# EAGLE design CMC_NIBP (EAGLE 9.1.2)
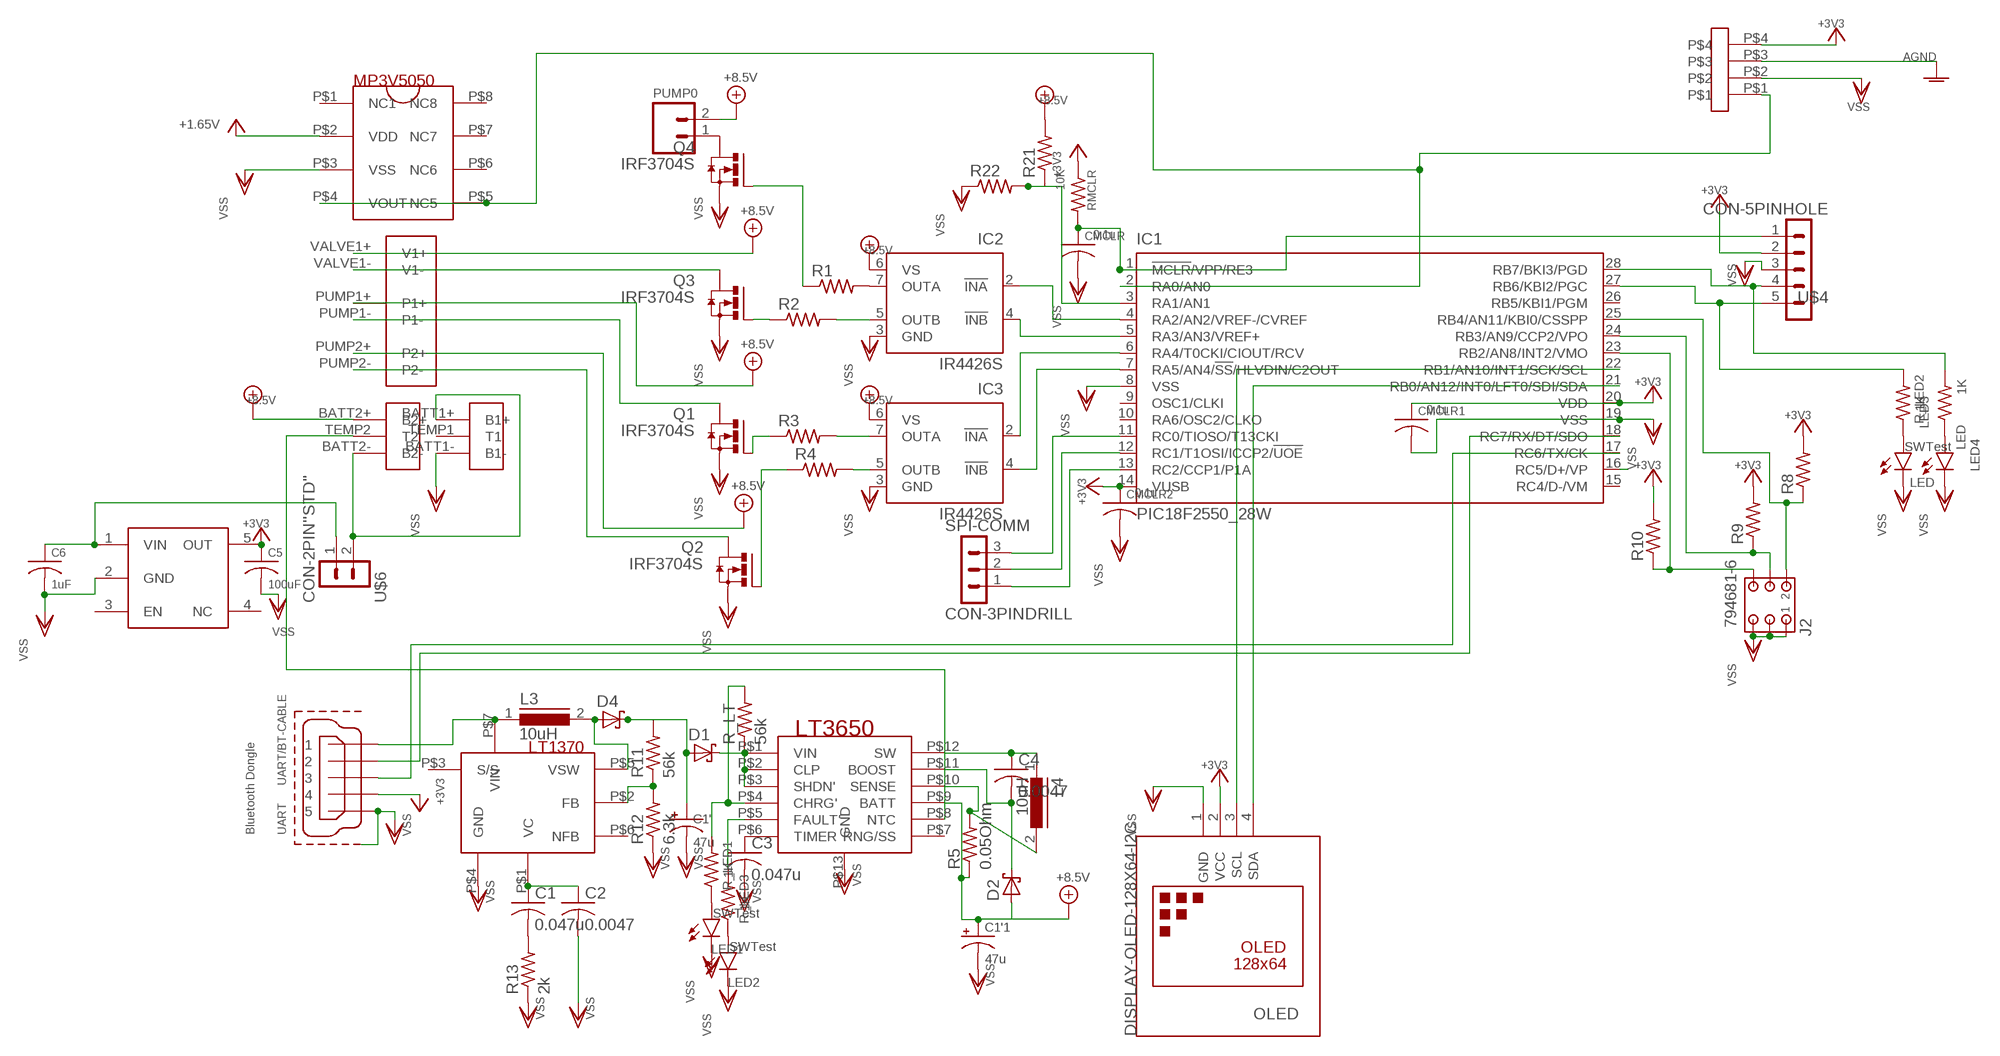
[diagram p0: schematic, sheet 1]

## Parts
C1  0.047u  C-USC1206  [C1206]
C1'  47u  CPOL-USE5-10.5  [E5-10,5]
C1'1  47u  CPOL-USE5-10.5  [E5-10,5]
C2  0.0047  C-USC1206  [C1206]
C3  0.047u  C-USC1206  [C1206]
C4  0.0047  C-USC1206  [C1206]
C5  100uF  C-USC1210  [C1210]
C6  1uF  C-USC0603  [C0603]
CMCLR  0.1u  C-USC0603  [C0603]
CMCLR1  0.1u  C-USC0603  [C0603]
CMCLR2  0.1u  C-USC0603  [C0603]
D1  SCHOTTKY-DIODESMD  [SMB]
D2  SCHOTTKY-DIODESMD  [SMB]
D4  SCHOTTKY-DIODESMD  [SMB]
IC1  PIC18F2550_28W  [SO28W]
IC2  IR4426S  [SO08]
IC3  IR4426S  [SO08]
IC-3.3VREG  LDO-MIC5307  [SOT23-5]
J2  794681-6  [794681-6]
L3  10uH  DR73  [DR73]
L4  10uH  DR73  [DR73]
LED  SWTest  LED3MM  [LED3MM]
LED1  SWTest  LED3MM  [LED3MM]
LED2  SWTest  LED3MM  [LED3MM]
LED3  1K  R-US_0204/2V  [0204V]
LED4  LED  LED3MM  [LED3MM]
OLED  DISPLAY-OLED-128X64-I2C  [DISPLAY-OLED-128X64-I2C]
PUMP0  Pump0  M02  [02P]
Q1  IRF3704S  [D2PACK]
Q2  IRF3704S  [D2PACK]
Q3  IRF3704S  [D2PACK]
Q4  IRF3704S  [D2PACK]
R1  R-US_M1206  [M1206]
R2  R-US_M1206  [M1206]
R3  R-US_M1206  [M1206]
R4  R-US_M1206  [M1206]
R5  0.05Ohm  R-US_M1206  [M1206]
R8  R-US_M1206  [M1206]
R9  R-US_M1206  [M1206]
R10  R-US_M1206  [M1206]
R11  56k  R-US_M1206  [M1206]
R12  6.3k  R-US_M1206  [M1206]
R13  2k  R-US_M1206  [M1206]
R21  R-US_M1206  [M1206]
R22  R-US_M1206  [M1206]
R_LED1  1K  R-US_0204/2V  [0204V]
R_LED2  1K  R-US_0204/2V  [0204V]
R_LED3  1K  R-US_0204/2V  [0204V]
R_LT  56k  R-US_M1206  [M1206]
RMCLR  10K  R-US_R0603  [R0603]
SPI-COMM  CON-3PINDRILL  [CON-3PIN]
U$1  NIBP_PNEUMATICS  [NIBP_PNEUM]
U$2  LT1370  [DD-PACK-7LEAD]
U$3  LT3650  [MSOP-12]
U$4  CON-5PINHOLE  [CON-5PIN]
U$5  CON-4PIN_SIL  [CONN-4PINSIL2]
U$6  CON-2PIN''STD"  [CON-2PIN]
UART/BT-CABLE  UART  MICRO-USB1  [MICRO-USB1]

## Nets
+3V3: C5.1 CMCLR1.1 CMCLR2.1 IC1.14(VUSB) IC1.20(VDD) IC-3.3VREG.5(OUT) OLED.2(VCC) R8.2 R9.2 R10.2 RMCLR.1 U$1.P$2(VDD) U$4.2 U$5.P$4 UART/BT-CABLE.4 ; supply symbol labelled +1.65V
+9V: C1'1.+ D2.A IC2.6(VS) IC3.6(VS) PUMP0.2 R5.1 R21.2 U$1.BATT2+(B2+) U$1.PUMP1+(P1+) U$1.PUMP2+(P2+) U$1.VALVE1+(V1+) U$3.P$9(BATT) ; supply symbol labelled +8.5V
+9V2: R_LED1.2 R_LT.2 U$3.P$4(CHRG')
AGND: U$5.P$3
BATT-MONITOR: IC1.3(RA1/AN1) R21.1 R22.2
DISP-SCL: IC1.22(RB1/AN10/INT1/SCK/SCL) OLED.3(SCL)
DISP-SDA: IC1.21(RB0/AN12/INT0/LFT0/SDI/SDA) OLED.4(SDA)
N$1: PUMP0.1 Q4.2(D)
N$2: U$1.TEMP2(T2) U$3.P$8(NTC)
N$3: IC1.16(RC5/D+/VP)
N$4: R_LED3.2 U$3.P$5(FAULT')
N$5: LED2.A R_LED3.1
N$6: U$1.BATT1+(B1+) U$1.BATT2-(B2-) U$6.2
N$7: C6.1 IC-3.3VREG.1(VIN) U$6.1
N$8: Q2.1(G) R4.1
N$9: Q1.1(G) R3.1
N$10: Q4.1(G) R1.1
N$11: IC3.7(OUTA) R3.2
N$12: IC2.7(OUTA) R1.2
N$13: IC2.5(OUTB) R2.2
N$14: L3.1 U$2.P$7(VIN) UART/BT-CABLE.1
N$16: IC3.5(OUTB) R4.2
N$23: D4.A L3.2 U$2.P$5(VSW)
N$24: LED3.1 LED4.A
N$25: C1'.+ D1.A D4.C R11.2
N$26: R11.1 R12.2 U$2.P$2(FB)
N$27: D1.C R_LT.1 U$3.P$1(VIN) U$3.P$2(CLP) U$3.P$3(SHDN')
N$28: C1.1 C2.1 U$2.P$1(VC)
N$29: C1.2 R13.2
N$30: C4.1 L4.1 U$3.P$12(SW)
N$31: C3.1 U$3.P$6(TIMER)
N$32: L4.2 R5.2 U$3.P$10(SENSE)
N$33: C4.2 D2.C U$3.P$11(BOOST)
N$34: LED1.A R_LED1.1
N$41: LED.A R_LED2.1
PGC: IC1.27(RB6/KBI2/PGC) R_LED2.2 U$4.5
PGD: IC1.28(RB7/BKI3/PGD) LED3.2 U$4.4
PIC-RX_CABLE-TX: IC1.18(RC7/RX/DT/SDO) UART/BT-CABLE.2
PIC-TX_CABLE-RX: IC1.17(RC6/TX/CK) UART/BT-CABLE.3
PRESSURE-SIG: IC1.2(RA0/AN0) U$1.P$4(VOUT) U$1.P$5(NC5) U$5.P$1
PUMP1: Q1.2(D) U$1.PUMP1-(P1-)
PUMP1-A: IC1.6(RA4/T0CKI/CIOUT/RCV) IC3.2(!INA)
PUMP2: Q2.2(D) U$1.PUMP2-(P2-)
PUMP2-A: IC1.7(RA5/AN4/!SS!/HLVDIN/C2OUT) IC3.4(!INB)
SCK: IC1.11(RC0/TIOSO/T13CKI) SPI-COMM.3
SDI: IC1.13(RC2/CCP1/P1A) SPI-COMM.1
SDO: IC1.12(RC1/T1OSI/ICCP2/!UOE) SPI-COMM.2
SW1: IC1.23(RB2/AN8/INT2/VMO) J2.6 R10.1
SW2: IC1.24(RB3/AN9/CCP2/VPO) J2.4 R9.1
SW3: IC1.25(RB4/AN11/KBI0/CSSPP) J2.2 R8.1
VALVE1-A: IC1.4(RA2/AN2/VREF-/CVREF) IC2.2(!INA)
VALVE2: Q3.2(D) U$1.VALVE1-(V1-)
VALVE2-A: IC1.5(RA3/AN3/VREF+) IC2.4(!INB)
VALVE2-B: Q3.1(G) R2.1
VPP: CMCLR.1 IC1.1(!MCLR!/VPP/RE3) RMCLR.2 U$4.1
VSS: C1'1.- C1'.- C2.2 C3.2 C5.2 C6.2 CMCLR1.2 CMCLR2.2 CMCLR.2 IC1.8(VSS) IC1.19(VSS) IC2.3(GND) IC3.3(GND) IC-3.3VREG.2(GND) J2.1 J2.3 J2.5 LED1.K(C) LED2.K(C) LED4.K(C) LED.K(C) OLED.1(GND) Q1.3(S) Q2.3(S) Q3.3(S) Q4.3(S) R12.1 R13.1 R22.1 U$1.BATT1-(B1-) U$1.P$3(VSS) U$2.P$4(GND) U$3.P$13(GND) U$4.3 U$5.P$2 UART/BT-CABLE.5
Unconnected: IC1.9(OSC1/CLKI) IC1.10(RA6/OSC2/CLKO) IC1.15(RC4/D-/VM) IC1.26(RB5/KBI1/PGM) IC-3.3VREG.3(EN) IC-3.3VREG.4(NC) U$1.P$1(NC1) U$1.P$6(NC6) U$1.P$7(NC7) U$1.P$8(NC8) U$1.TEMP1(T1) U$2.P$3(S/S) U$2.P$6(NFB) U$3.P$7(RNG/SS)

## Notes on the sheet
- Bluetooth Dongle

## Library data of the parts
C1-C6 CMCLR CMCLR1 CMCLR2 = rcl:C-US: CAPACITOR, American symbol; SPICEPREFIX: C
C1' C1'1 = rcl:CPOL-US: POLARIZED CAPACITOR, American symbol; SPICEPREFIX: C
D1 D2 D4 = diode:SCHOTTKY-DIODE: Schottky Diode
IC1 = CMCbioengg:PIC18F2*_28: USB Microcontrollers with nanoWatt Technology High-Performance, Enhanced Flash, 28/40/44-Pin, Source: http://ww1.microchip.com/downloads/en/devicedoc/39632c.pdf; MF: MICROCHIP; MPN: PIC18F2550-I/SO; OC_FARNELL: 9321268; OC_NEWARK: 73K1297
IC2 IC3 = ir:IR4426: DUAL LOW SIDE DRIVER Source: ID4426.pdf; MF: INTERNATIONAL RECTIFIER(IR); MPN: IR4426S; OC_FARNELL: 1023266; OC_NEWARK: 27C6913
IC-3.3VREG = surdev_Aug2015:LDO-MIC5307
J2 = con-amp:794681-6: Micro MATE-N-LOK Connectors grid 1.5mm Dual Row Through Hole Vertical Metal Through Hole Holddowns Source: ENG_CD_794681_E.pdf
L3 L4 = inductors:DR73: High Power Density, High Efficiency, Shielded Inductors Source: coiltronics_dr_series.pdf; SPICEPREFIX: L
LED LED1 LED2 LED4 = led:LED: LED OSRAM: - CHIPLED LG R971, LG N971, LY N971, LG Q971, LY Q971, LO R971, LY R971 LH N974, LH R974 LS Q976, LO Q976, LY Q976 LO Q996 - Hyper CHIPLED LW Q18S LB Q993, LB Q99A, LB R99A - SideLED LS A670, LO A670, LY A670, LG A670, LP A670 LB A673, LV A673, LT A673, LW A673 LH A674 LY A675 LS A676, LA A676, LO A676, LY A676, LW A676 LS A679, LY A679, LG A679 - Hyper Micro SIDELED® LS Y876, LA Y876, LO Y876, LY Y876 LT Y87S - SmartLED LW L88C, LW L88S LB L89C, LB L89S, LG L890 LS L89K, LO L89K, LY L89K LS L896, LA L896, LO L896, LY L896 - TOPLED LS T670, LO T670, LY T670, LG T670, LP T670 LSG T670, LSP T670, LSY T670, LOP T670, LYG T670 LG T671, LOG T671, LSG T671 LB T673, LV T673, LT T673, LW T673 LH T674 LS T676, LA T676, LO T676, LY T676, LB T676, LH T676, LSB T676, LW T676 LB T67C, LV T67C, LT T67C, LS T67K, LO T67K, LY T67K, LW E67C LS E67B, LA E67B, LO E67B, LY E67B, LB E67C, LV E67C, LT E67C LW T67C LS T679, LY T679, LG T679 LS T770, LO T770, LY T770, LG T770, LP T770 LB T773, LV T773, LT T773, LW T773 LH T774 LS E675, LA E675, LY E675, LS T675 LS T776, LA T776, LO T776, LY T776, LB T776 LHGB T686 LT T68C, LB T68C - Hyper Mini TOPLED® LB M676 - Mini TOPLED Santana® LG M470 LS M47K, LO M47K, LY M47K Source: http://www.osram.convergy.de LUXEON: - LUMILED® LXK2-PW12-R00, LXK2-PW12-S00, LXK2-PW14-U00, LXK2-PW14-V00 LXK2-PM12-R00, LXK2-PM12-S00, LXK2-PM14-U00 LXK2-PE12-Q00, LXK2-PE12-R00, LXK2-PE12-S00, LXK2-PE14-T00, LXK2-PE14-U00 LXK2-PB12-K00, LXK2-PB12-L00, LXK2-PB12-M00, LXK2-PB14-N00, LXK2-PB14-P00, LXK2-PB14-Q00 LXK2-PR12-L00, LXK2-PR12-M00, LXK2-PR14-Q00, LXK2-PR14-R00 LXK2-PD12-Q00, LXK2-PD12-R00, LXK2-PD12-S00 LXK2-PH12-R00, LXK2-PH12-S00 LXK2-PL12-P00, LXK2-PL12-Q00, LXK2-PL12-R00 Source: www.luxeon.com KINGBRIGHT: KA-3528ASYC Source: www.kingbright.com
LED3 R1-R5 R8-R13 R21 R22 R_LED1-R_LED3 R_LT RMCLR = rcl:R-US_: RESISTOR, American symbol; SPICEPREFIX: R
OLED = diy-modules:DISPLAY-OLED-128X64-I2C: 128x64 Dot Matrix OLED Module based on SSD1306 chip Variant with I2C interface More details available here: http://www.instructables.com/id/Monochrome-096-i2c-OLED-display-with-arduino-SSD13/ SSD1306 datasheet: https://cdn-shop.adafruit.com/datasheets/SSD1306.pdf Click here to find device on ebay.com <http://www.ebay.com/sch/oled+display+128x64+iic> Note: There are two variants: I2C and SPI. Search for the proper version.
PUMP0 = con-amp-quick:M02: AMP QUICK CONNECTOR; OC_FARNELL: unknown; OC_NEWARK: unknown
Q1-Q4 = transistor-power:IRF3704: SMPS MOSFET HEXFET® Power MOSFET Source: http://www.irf.com/product-info/datasheets/data/irf3704.pdf
SPI-COMM = CMCbioengg:CON-3PIN
U$1 = CMCbioengg:NIBP_PNEUMATICS
U$2 = CMCbioengg:LT1370
U$3 = CMCbioengg:LT3650
U$4 = CMCbioengg:CON-5PIN
U$5 = CMCbioengg:CON-4PIN_SIL
U$6 = CMCbioengg:CON-2PIN
UART/BT-CABLE = Syrpai_01012015:MICRO-USB1

## Net classes
1 power: width 0.61 mm, drill 0.61 mm, clearance 0.254 mm
2 gnd: width 0.305 mm, drill 0.559 mm, clearance 0.254 mm
3 usbvcc: width 0.508 mm, drill 0.61 mm, clearance 0.254 mm
4 aref: width 0.406 mm, drill 0.61 mm, clearance 0.254 mm

## Board
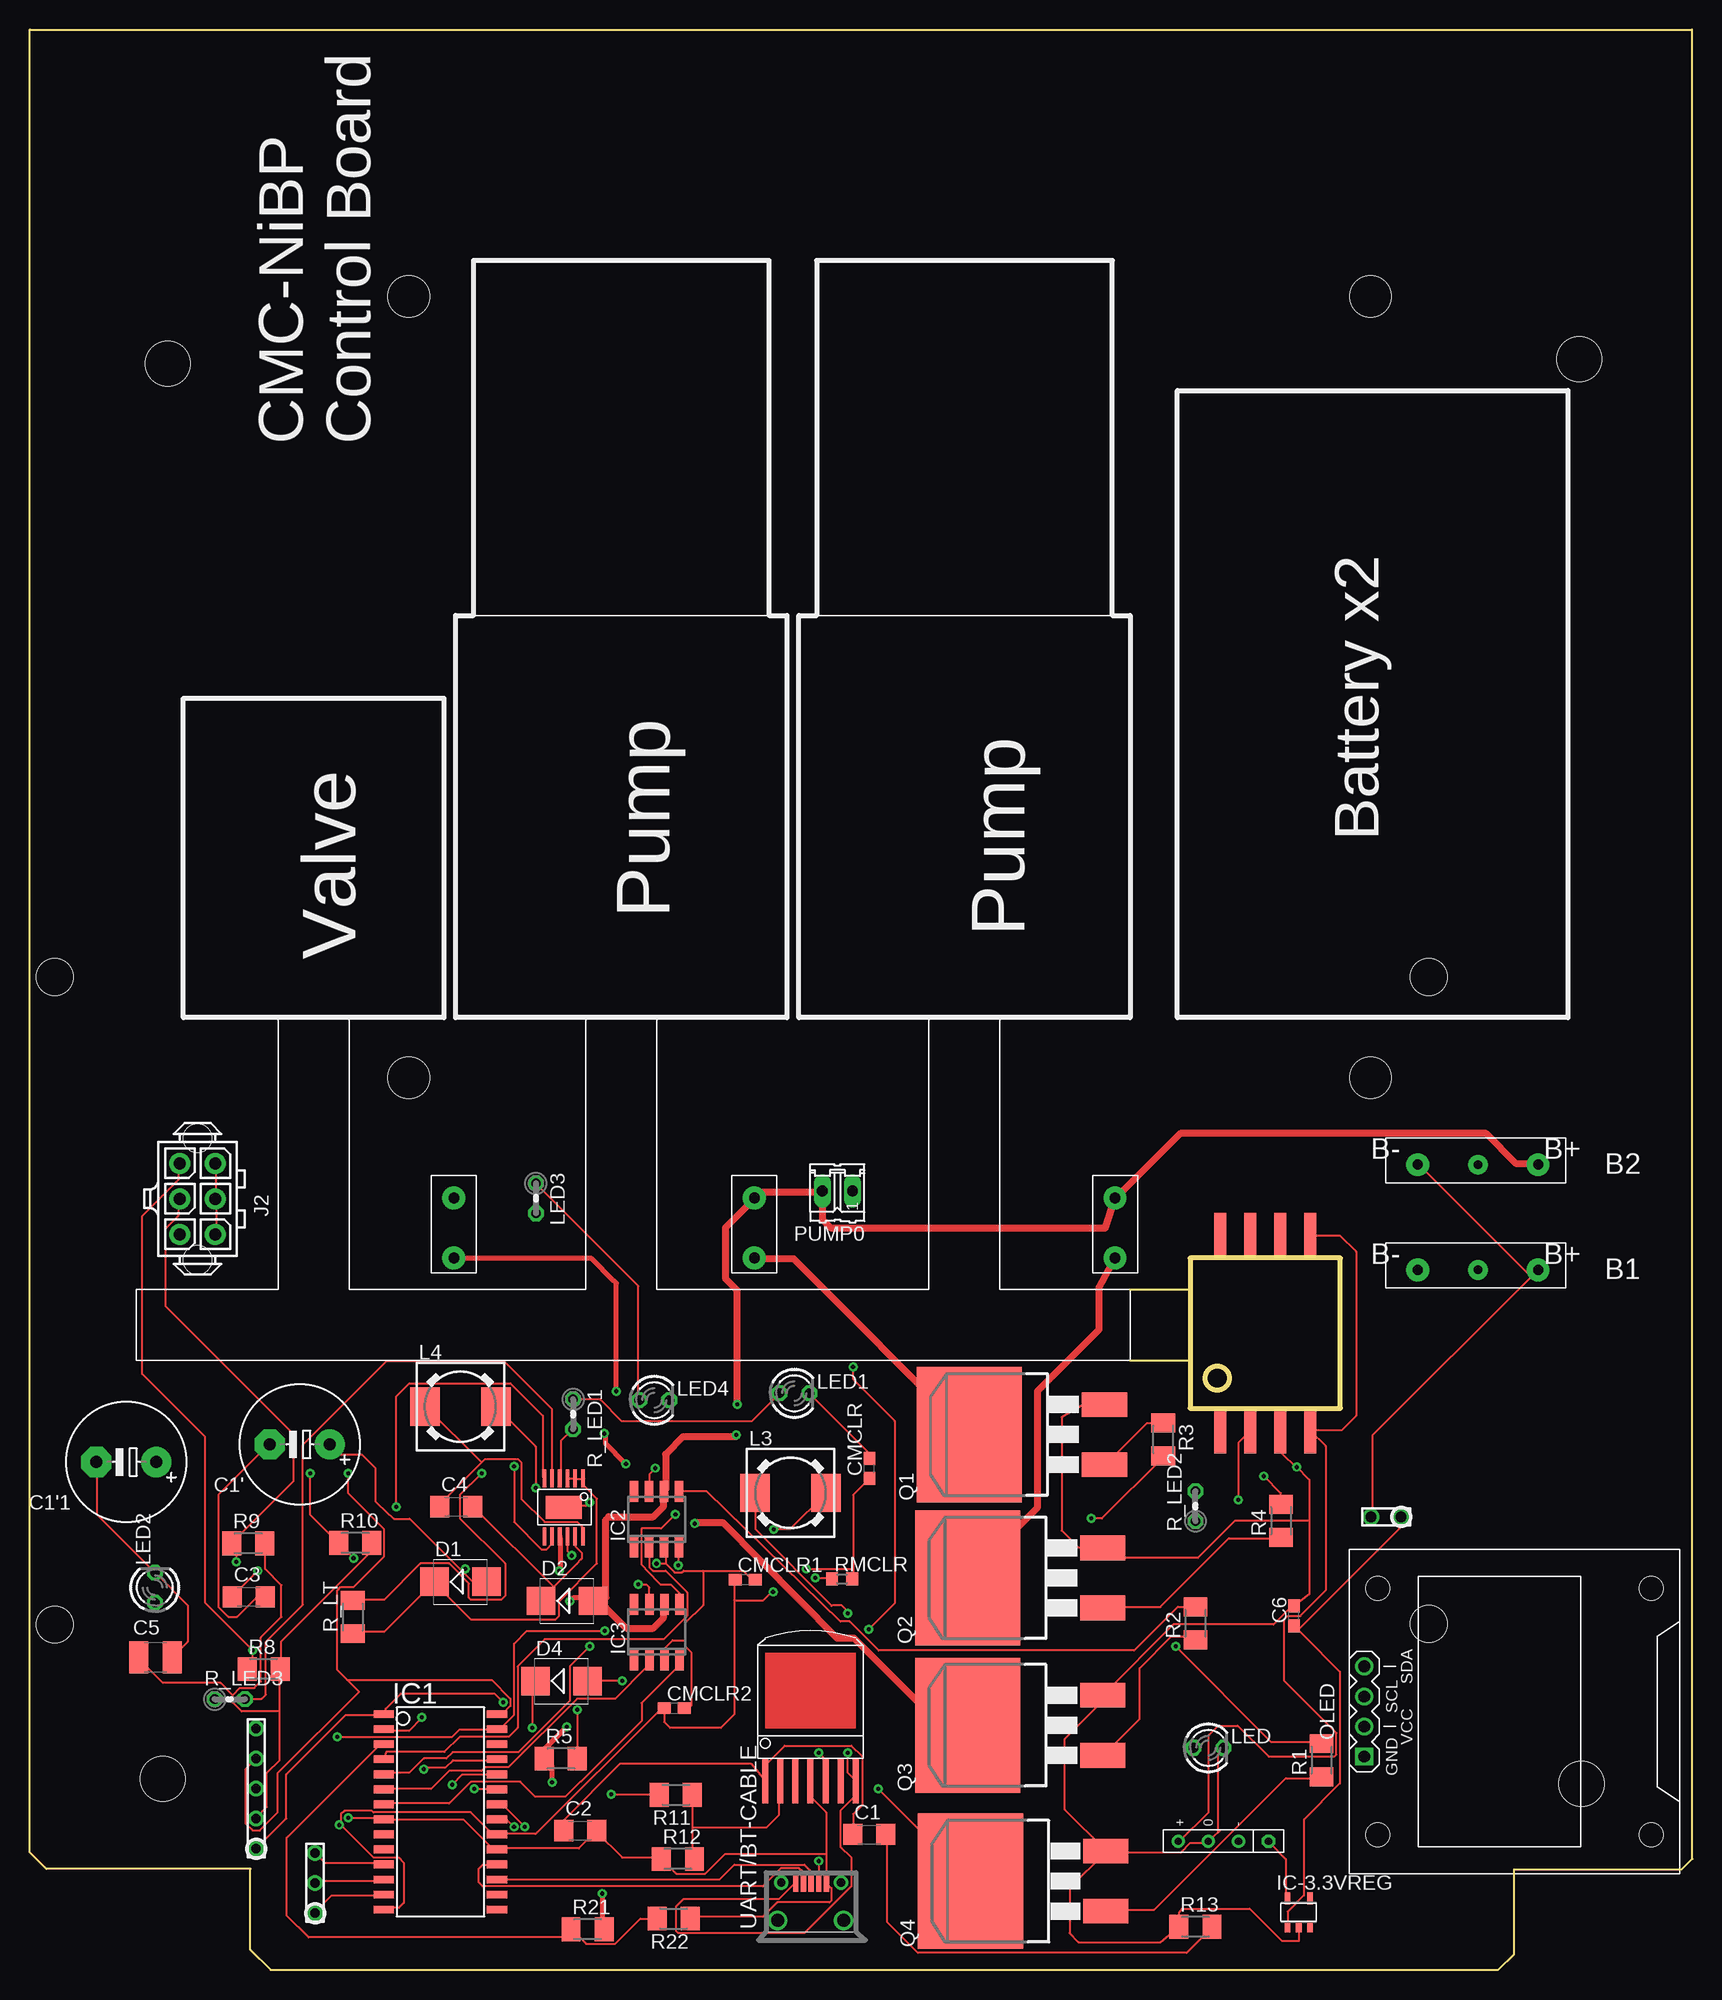
[diagram p1: board, top side]
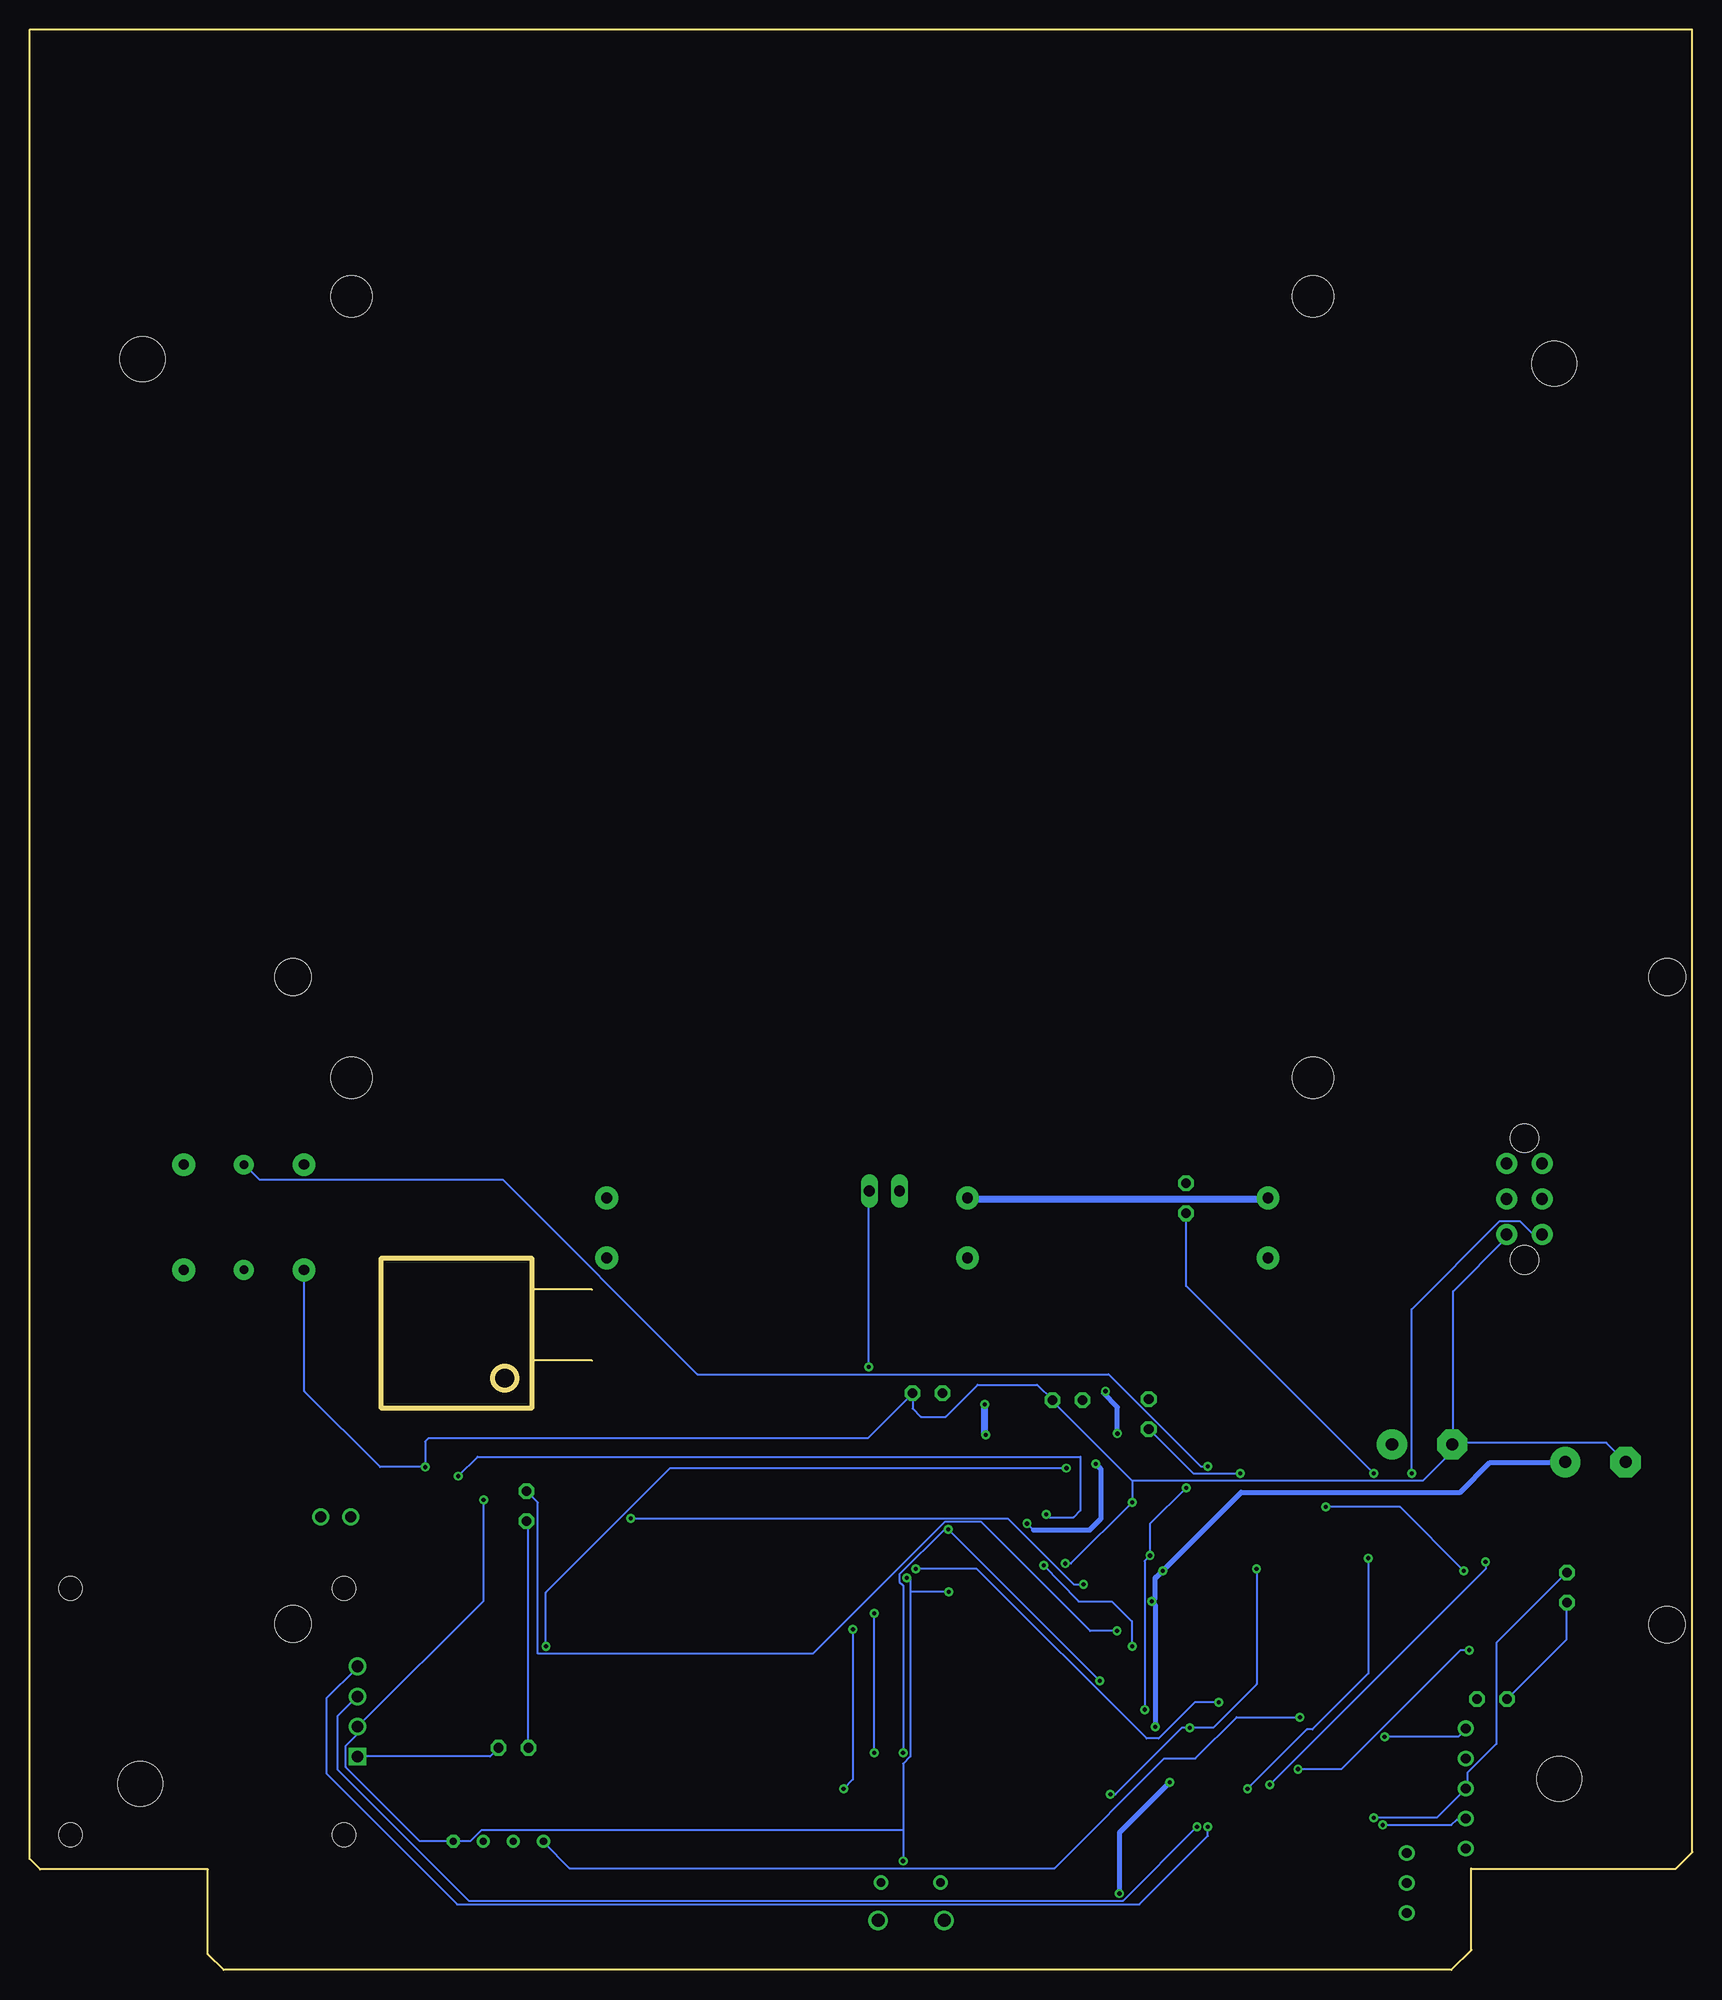
[diagram p2: board, bottom side, seen from below]

Size 140.51 x 164.02 mm. Coordinates in mm from the lower left corner, seen from the top.
Outline: 18.66,1.71 20.37,0 124.11,0 125.45,1.34 125.45,8.49
Outline: 18.68,8.54 1.41,8.54 0,9.95 0.01,164
Outline: 125.45,8.49 139.62,8.49 140.51,9.38 140.5,164.02
Outline: 0.04,164.02 140.5,164.02 140.5,164.02
Outline: 18.66,1.69 18.66,8.55 18.68,8.55
Copper layers (1*16): Top 0.035mm / dielectric 1.5mm / Bottom 0.035mm
Design rules "default": minimum track width 6mil, minimum drill 0.35mm, track to track 6mil, track to pad 6mil, pad to pad 6mil, via to via 6mil, smd to smd 6mil, copper to edge 40mil, drill to drill 6mil, minimum pad ring 10mil, minimum via ring 8mil, stop-mask expansion 4mil, vias tented up to drill 0mil, thermal gap 10mil
Holes 3.1 mm at 2.13,29.19 2.13,83.94 118.25,83.94 118.25,29.26
Holes 3.8 mm at 11.24,16.17 11.67,135.79 130.98,136.17 131.15,15.72

### Footprints (pad centres in the part's own frame; a part is rotated, then mirrored left to right if it is on the bottom)
C1206 = smd 1.6 x 1.8: 1 -1.4,0; 2 1.4,0
E5-10,5 = drill 1.016 pad 2.54: + -2.54,0 | drill 1.016 pad 2.54 octagon: - 2.54,0
C1210 = smd 1.6 x 2.7: 1 -1.4,0; 2 1.4,0
C0603 = smd 1.1 x 1: 1 -0.85,0; 2 0.85,0
SMB = smd 2.4 x 2.4: A 2.2,0; C -2.2,0
SO28W = smd 0.65 x 1.7: 1 -7.62,-4.78; 2 -6.35,-4.78; 3 -5.08,-4.78; 4 -3.81,-4.78; 5 -2.54,-4.78; 6 -1.27,-4.78; 7 0,-4.78; 8 1.27,-4.78; 9 2.54,-4.78; 10 3.81,-4.78; 11 5.08,-4.78; 12 6.35,-4.78; 13 7.62,-4.78; 14 8.89,-4.78; 15 8.89,4.78; 16 7.62,4.78; 17 6.35,4.78; 18 5.08,4.78; 19 3.81,4.78; 20 2.54,4.78; 21 1.27,4.78; 22 0,4.78; 23 -1.27,4.78; 24 -2.54,4.78; 25 -3.81,4.78; 26 -5.08,4.78; 27 -6.35,4.78; 28 -7.62,4.78
SO08 = smd 0.72 x 1.78: 1 -1.905,-2.35; 2 -0.635,-2.35; 3 0.635,-2.35; 4 1.905,-2.35; 5 1.905,2.35; 6 0.635,2.35; 7 -0.635,2.35; 8 -1.905,2.35
SOT23-5 = smd 0.5 x 1: 1 -0.95,-1.2; 2 0,-1.2; 3 0.95,-1.2; 4 0.95,1.2; 5 -0.95,1.2
794681-6 = drill 1 pad 1.778: 1 3,-1.5; 2 3,1.5; 3 0,-1.5; 4 0,1.5; 5 -3,-1.5; 6 -3,1.5 | hole 2.4: 5.13,0; -5.17,0
DR73 = smd 2.5 x 3.25: 1 -3,0; 2 3,0
LED3MM = drill 0.813 octagon: A -1.27,0; K 1.27,0
0204V = drill 0.813 octagon: 1 -1.27,0; 2 1.27,0
DISPLAY-OLED-128X64-I2C = drill 1 square: 1 -3.81,12.7 | drill 1: 2 -1.27,12.7; 3 1.27,12.7; 4 3.81,12.7 | hole 2: -10.414,11.557; 10.414,11.557; 10.414,-11.557; -10.414,-11.557
02P = drill 0.914 long: 1 -1.27,0; 2 1.27,0
D2PACK = smd 2.083 x 3.81: 1 -2.54,-8.89; 3 2.54,-8.89 | smd 11.43 x 8.89: 2 0,2.54
M1206 = smd 1.6 x 2: 1 -1.4,0; 2 1.4,0
R0603 = smd 1 x 1.1: 1 -0.85,0; 2 0.85,0
CON-3PIN = drill 0.813: 1 2.575,0; 2 0.035,0; 3 -2.505,0
NIBP_PNEUM = drill 0.85 pad 1.93: BATT1+ -21.32,-34.48; BATT1- -21.32,-24.32; BATT2+ -12.43,-34.48; BATT2- -12.43,-24.32 | smd 3.81 x 1.016: P$1 -34.925,-7.62; P$2 -34.925,-10.16; P$3 -34.925,-12.7; P$4 -34.925,-15.24; P$5 -18.415,-15.24; P$6 -18.415,-12.7; P$7 -18.415,-10.16; P$8 -18.415,-7.62 | drill 0.9 pad 1.93: PUMP1+ -15.24,31.75; PUMP1- -20.32,31.75; PUMP2+ -15.24,1.27; PUMP2- -20.32,1.27; VALVE1+ -15.24,57.15; VALVE1- -20.32,57.15 | drill 0.7 pad 1.676: TEMP1 -21.32,-29.4; TEMP2 -12.43,-29.4 | hole 3.5: 60.96,-20.32; -5.08,-20.32; -5.08,60.96; 60.96,60.96
DD-PACK-7LEAD = smd 0.508 x 3.81: P$1 -3.81,-5.715; P$2 -2.54,-5.715; P$3 -1.27,-5.715; P$4 0,-5.715; P$5 1.27,-5.715; P$6 2.54,-5.715; P$7 3.81,-5.715
MSOP-12 = smd 0.3 x 1.5: P$1 -1.3,-2.45; P$2 -0.65,-2.45; P$3 0,-2.45; P$4 0.65,-2.45; P$5 1.3,-2.45; P$6 1.95,-2.45; P$7 1.95,2.45; P$8 1.3,2.45; P$9 0.65,2.45; P$10 0,2.45; P$11 -0.65,2.45; P$12 -1.3,2.45 | smd 3.048 x 1.905: P$13 0.318,0
CON-5PIN = drill 0.813: 1 5.115,0; 2 2.575,0; 3 0.035,0; 4 -2.505,0; 5 -5.045,0
CONN-4PINSIL2 = drill 0.6: P$1 0,3.81; P$2 0,1.27; P$3 0,-1.27 | drill 0.6 octagon: P$4 0,-3.81
CON-2PIN = drill 0.9: 1 1.305,-1.27; 2 -1.235,-1.27
MICRO-USB1 = smd 0.45 x 1.7: 1 -1.28,2.16; 2 -0.63,2.16; 3 0.02,2.16; 4 0.67,2.16; 5 1.32,2.16 | drill 0.7 pad 1: P$1 -2.5,2.07; P$3 2.54,2.07 | drill 1.1 pad 1.5: P$2 -2.803,-1.125; P$5 2.77,-1.13

### Placement (x,y rotation side)
C1  70.97,11.46 0 top
C1'  22.84,44.42 180 top
C1'1  8.18,42.93 180 top
C2  46.55,11.78 0 top
C3  18.53,31.54 0 top
C4  36.05,39.17 0 top
C5  10.64,26.43 0 top
C6  106.86,29.94 90 top
CMCLR  70.98,42.39 90 top
CMCLR1  60.47,33 0 top
CMCLR2  54.48,22.13 0 top
D1  36.43,32.82 0 top
D2  45.42,31.19 0 top
D4  44.96,24.42 0 top
IC1  34.72,14 270 top
IC2  52.99,38.1 0 top
IC3  53,28.56 0 top
IC-3.3VREG  107.26,4.87 0 top
J2  14.2,65.18 90 top
L3  64.31,40.33 0 top
L4  36.4,47.61 0 top
LED  99.62,18.78 0 top
LED1  64.63,48.75 0 top
LED2  10.59,32.32 90 top
LED3  42.79,65.22 270 top
LED4  52.79,48.17 0 top
OLED  125.5,21.84 90 top
PUMP0  68.27,65.84 180 top
Q1  81.95,45.26 90 top
Q2  81.82,33.14 90 top
Q3  81.82,20.68 90 top
Q4  82.05,7.51 90 top
R1  109.18,17.73 90 top
R2  98.52,29.3 90 top
R3  95.81,44.85 270 top
R4  105.75,37.96 90 top
R5  44.89,17.88 0 top
R8  19.79,25.43 0 top
R9  18.48,36.06 0 top
R10  27.52,36.1 0 top
R11  54.62,14.81 180 top
R12  54.79,9.39 0 top
R13  98.53,3.65 0 top
R21  47.16,3.44 0 top
R22  54.43,4.34 180 top
R_LED1  45.94,46.97 270 top
R_LED2  98.53,39.21 90 top
R_LED3  16.92,22.88 0 top
R_LT  27.31,29.83 90 top
RMCLR  68.66,33.05 0 top
SPI-COMM  24.13,7.39 270 top
U$1  93,80.5 90 top
U$2  66,21.7 0 top
U$3  45.46,39.1 180 top
U$4  19.15,15.37 270 top
U$5  100.89,10.88 90 top
U$6  114.6,39.57 0 top
UART/BT-CABLE  66.03,5.31 0 top

### Tracks (layer width: path | path; a pad name or v marks a point on that pad's centre or on a via)
+3V3  (via drill 0.35)
  Top 0.152: IC-3.3VREG.5 106.17,6.15 106.17,9.35 104.8,10.73 U$5.P$4 | U$1.P$2 102.15,44.56 v102.15,39.74 | 21.13,21.85 21.13,17.72 20.06,16.65 20.06,13.77 19.15,12.86 U$4.2 | 21.13,21.85 21.13,25.36 R8.2 21.28,25.51 21.28,27.8 28.9,35.42 28.9,36.02 R10.2 | 17.17,23.22 17.78,23.83 19,23.83 19.54,24.38 19.54,28.09 21.28,29.83 21.28,32.52 19.91,33.89 19.91,36.02 R9.2 | 17.17,23.22 17.17,22.61 17.93,21.85 21.13,21.85 | 17.17,23.22 16.14,24.25 11.26,24.25 9.55,25.97 9.61,26.06 C5.1 | 26.31,12.25 29.05,9.51 31.18,9.51 31.64,9.06 31.64,5.67 31.21,5.24 29.97,5.24 IC1.14 | 26.31,12.25 26.31,13.16 26.62,13.47 28.9,13.47 29.05,13.32 37.28,13.32 39.11,11.49 39.42,11.49 IC1.20 39.57,11.49 42.77,11.49 53.29,22 53.59,22 CMCLR2.1 53.63,20.97 54.14,20.46 58.41,20.46 59.53,21.59 59.53,31.26 | 59.53,31.26 59.53,32.98 CMCLR1.1 | v66.39,33.13 67.76,33.13 RMCLR.1 | v62.83,31.97 62.73,31.97 62.01,31.26 59.53,31.26 | v66.7,9.2 66.7,7.53 UART/BT-CABLE.4 | 26.31,12.25 v26.16,12.25
  Bottom 0.152: v102.15,39.74 102.15,31.2 112.72,20.63 OLED.2 112.87,20.48 112.87,19.87 113.79,18.96 113.79,17.13 107.54,10.88 104.8,10.88 U$5.P$4 104.64,10.88 103.27,10.88 102.36,11.79 66.7,11.79 | v62.83,31.97 66.09,31.97 | 66.7,11.79 66.7,17.43 66.09,18.04 66.09,31.97 | 66.7,11.79 v66.7,9.2 | 66.09,31.97 66.09,33.13 v66.39,33.13 | v26.16,12.25 20.36,12.25 19.9,12.71 19.15,12.71 U$4.2
+9V  (via drill 0.35)
  Top 0.152: D2.A 47.36,31.45 | 48.26,31.91 47.65,31.3 D2.A | 53.59,40.44 IC2.6 | 48.26,31.91 48.69,31.47 | 53.59,30.84 IC3.6 | 48.26,31.91 D2.A | 43.49,18.66 R5.1 44.15,17.22 | 48.41,3.56 R21.2 | 61.82,65.74 61.36,65.29 U$1.PUMP1+ 61.21,65.13 | 66.85,65.74 PUMP0.2 | 127.35,68.18 U$1.BATT2+ | 91.84,65.29 U$1.PUMP2+ | 59.72,45.08 v59.72,45.24 | 59.79,57.46 59.72,57.54
  Top 0.406: U$3.P$9 44.81,36.55 44.83,36.53 44.83,33.82 v44.75,33.74 | 47.36,31.45 45.97,31.45 v45.67,31.15 | 48.69,38.07 48.94,38.31 | 48.69,30.62 48.69,31.47 | v45.4,20.56 43.49,18.66 | v48.41,6.46 48.41,3.56 | v44.15,15.86 44.15,17.22 | 53.74,40.6 IC2.6
  Top 0.61: 53.59,40.44 53.59,39.19 52.71,38.31 48.94,38.31 | 48.69,31.47 48.69,38.07 | 53.59,30.84 53.59,29.77 52.71,28.89 50.43,28.89 48.69,30.62 | 61.82,65.74 66.85,65.74 | PUMP0.2 67,63.46 67.76,62.7 90.89,62.7 U$1.PUMP2+ | 127.35,68.18 125.61,68.18 123.04,70.75 97.3,70.75 91.84,65.29 | 53.74,40.6 53.74,43.6 55.23,45.08 59.72,45.08 | 59.72,57.54 58.8,58.46 58.8,62.72 61.21,65.13 | v59.79,47.81 59.79,57.46
  Bottom 0.152: v45.67,31.15 45.4,30.88 | 10.77,42.88 C1'1.+ | v59.72,45.24 59.79,45.31
  Bottom 0.406: v45.67,31.15 45.42,31.4 45.42,33.13 45.36,33.19 45.3,33.19 v44.75,33.74 38.12,40.37 19.6,40.37 17.09,42.88 10.77,42.88 | 45.4,30.88 v45.4,20.56 | v48.41,6.46 48.41,11.6 v44.15,15.86 | U$1.PUMP1+ 61.18,65.19 | 35.93,65.19 U$1.VALVE1+
  Bottom 0.61: 61.18,65.19 35.93,65.19 | 59.79,45.31 v59.79,47.81
+9V2  (via drill 0.35)
  Top 0.152: U$3.P$4 44.9,41.66 44.9,44.71 45.82,45.63 R_LED1.2 | v38.2,41.97 36.37,40.14 36.37,38.16 40.18,34.35 40.18,31.61 39.87,31.3 37.28,31.3 37.13,31.45 37.13,32.67 35.46,34.35 33.02,34.35 29.97,31.3 27.38,31.3 R_LT.2
  Bottom 0.152: v38.2,41.97 42.16,41.97 45.82,45.63 R_LED1.2
BATT-MONITOR
  Top 0.152: IC1.3 29.82,18.96 29.51,18.96 21.73,11.18 21.73,4.6 23.58,2.75 45.07,2.75 R21.1 45.82,3.41 47.04,2.19 49.48,2.19 51.61,4.33 52.98,4.33 R22.2
DISP-SCL  (via drill 0.35)
  Top 0.152: v41.86,12.1 40.03,13.93 39.57,13.93 IC1.22
  Bottom 0.152: v41.86,12.1 48.1,5.85 103.4,5.85 114.51,16.96 114.51,21.44 112.87,23.07 OLED.3
DISP-SDA  (via drill 0.35)
  Top 0.152: v40.94,12.1 40.33,12.71 39.57,12.71 IC1.21
  Bottom 0.152: v40.94,12.1 40.94,11.32 46.72,5.54 104.37,5.54 115.43,16.61 115.43,22.95 112.87,25.51 OLED.4
N$1  (via drill 0.35)
  Top 0.152: v69.59,50.96 69.59,49.92 73.11,46.41 73.11,30.97 v70.93,28.79 | v71.73,15.3 79.5,7.53 Q4.2
  Bottom 0.152: v69.59,50.96 69.59,65.74 PUMP0.1 | v70.93,28.79 70.93,16.09 v71.73,15.3
N$2  (via drill 0.35)
  Top 0.152: v40.94,42.58 40.94,37.85 43.23,35.57 43.68,35.57 44.14,36.02 44.14,36.63 U$3.P$8
  Bottom 0.152: v40.94,42.58 41.55,42.58 49.32,50.35 84.07,50.35 100.53,66.81 121.1,66.81 122.32,68.03 U$1.TEMP2
N$4
  Top 0.152: U$3.P$5 44.14,41.66 44.14,47.42 40.06,51.5 30.2,51.5 23.1,44.39 23.1,30.87 19.97,27.74 19.97,23.27 19.62,22.92 18.23,22.92 R_LED3.2
N$5
  Bottom 0.152: LED2.A 10.61,31 10.61,27.95 15.64,22.92 R_LED3.1
N$6
  Top 0.152: 126.9,58.58 127.35,59.04 U$1.BATT1+ 126.9,58.58 | 126.9,58.58 113.48,45.17 113.48,38.31 U$6.2 | 126.9,58.58 117.45,68.03 U$1.BATT2-
N$7
  Top 0.152: 107.21,28.73 106.93,29.01 C6.1 | 107.21,28.73 107.68,28.26 110.74,25.2 110.74,15.76 107.69,12.71 107.69,6.31 106.32,4.94 106.32,3.72 IC-3.3VREG.1 | 107.21,28.73 115.77,37.29 115.77,38.16 U$6.1
N$8
  Top 0.152: R4.1 105.71,36.48 101.35,36.48 95.56,30.69 90.78,30.69 Q2.1
N$9
  Top 0.152: R3.1 95.81,46.24 94.43,46.24 90.93,42.73 Q1.1
N$10
  Top 0.152: R1.1 109.06,16.21 106.17,16.21 95.04,5.09 91.08,5.09 Q4.1
N$11  (via drill 0.35)
  Top 0.152: IC3.7 52.37,32.33 52.11,32.59 v51.45,32.59 | v89.71,38.16 90.62,38.16 95.81,43.34 R3.2
  Bottom 0.152: v51.45,32.59 52.26,32.59 57.83,38.16 v89.71,38.16
N$12  (via drill 0.35)
  Top 0.152: v52.89,42.42 52.37,41.9 52.37,40.6 IC2.7 | v96.87,27.34 104.95,19.26 109.06,19.26 R1.2
  Bottom 0.152: v52.89,42.42 86.36,42.42 96.87,31.91 v96.87,27.34
N$13
  Top 0.152: IC2.5 54.96,40.44 57.25,40.44 68.52,29.45 69.31,29.45 71.75,27.01 93.34,27.01 97.04,30.7 R2.2
N$14  (via drill 0.35)
  Top 0.152: UART/BT-CABLE.1 64.72,7.37 63.34,6 55.27,6 54.66,5.39 54.66,3.26 54.81,3.11 65.48,3.11 69.44,7.07 69.44,9.51 68.53,10.42 68.53,13.47 69.75,14.69 69.75,15.91 U$2.P$7 69.75,16.06 69.14,16.67 v69.14,18.35 | v69.14,30.15 69.14,30.31 68.64,30.81 67.82,30.81 67.77,30.76 61.36,37.24 61.36,40.29 L3.1
  Bottom 0.152: v69.14,18.35 v69.14,30.15
N$16  (via drill 0.35)
  Top 0.152: IC3.5 54.91,31.87 54.22,32.56 53.35,32.56 53.11,32.8 51.69,34.28 51.69,37.31 53.37,37.31 v54.58,38.52 | R4.2 105.75,40.29 v104.3,41.74
  Bottom 0.152: v54.58,38.52 54.32,38.26 52.29,38.26 51.71,38.84 51.71,43.39 102.65,43.39 v104.3,41.74
N$23  (via drill 0.35)
  Top 0.152: v50.09,24.44 47.19,24.44 D4.A | v62.89,37.24 64.26,37.24 67.31,40.29 L3.2 | v66.7,18.35 67.15,17.89 67.15,16.06 U$2.P$5
  Bottom 0.152: v50.09,24.44 v62.89,37.24 63.19,37.24 67,33.43 67,32.82 66.7,32.52 v66.7,18.35
N$24
  Top 0.152: LED3.1 51.46,57.82 51.46,48.22 LED4.A
N$25  (via drill 0.35)
  Top 0.152: v49.17,14.84 53.13,14.84 R11.2 | v42.47,20.48 42.47,24.14 42.62,24.29 D4.C | 36.37,33.89 32.12,38.14 30.78,38.14 29.44,39.38 29.24,39.57 29.24,42.4 28.1,43.54 25.38,43.54 C1'.+ | 36.37,33.89 37.44,32.82 38.5,32.82 D1.A | 36.37,33.89 v36.83,33.89
  Bottom 0.152: v49.17,14.84 48.76,14.84 43.13,20.48 v42.47,20.48 40.5,20.48 36.83,24.15 v36.83,33.89
N$26
  Top 0.152: 56.03,12.07 56.03,9.66 56.18,9.51 R12.2 | 56.03,12.07 56.03,14.69 R11.1 | 56.03,12.07 62.31,12.07 63.34,13.1 63.34,15.91 U$2.P$2
N$27
  Top 0.152: U$3.P$3 45.51,41.51 45.97,41.51 U$3.P$2 46.12,41.51 46.73,41.51 U$3.P$1 46.89,41.51 46.89,40.9 47.95,39.83 47.95,34.35 44.75,31.15 44.75,29.93 44.45,29.62 37.28,29.62 34.24,32.67 D1.C 34.08,32.67 29.97,28.56 27.38,28.56 R_LT.1
N$28
  Top 0.152: C1.1 69.59,11.49 69.59,13.16 70.35,13.93 70.35,18.04 69.44,18.96 63.8,18.96 62.28,17.43 62.28,16.06 U$2.P$1 61.01,17.41 49.89,17.41 45.15,12.66 C2.1
N$29
  Top 0.152: C1.2 72.49,11.34 72.49,4.02 75.08,1.43 97.79,1.43 99.92,3.56 R13.2
N$30
  Top 0.152: 38.2,42.88 34.54,39.23 C4.1 | 38.2,42.88 38.5,43.19 41.25,43.19 41.55,42.88 41.55,39.83 43.53,37.85 46.28,37.85 46.73,37.4 46.73,36.79 U$3.P$12 | 38.2,42.88 33.47,47.61 L4.1
N$31  (via drill 0.35)
  Top 0.152: v30.98,39.13 30.98,48.46 32.1,49.59 40.64,49.59 43.38,46.85 43.38,41.66 U$3.P$6 | v19.3,33.74 17.17,31.61 C3.1
  Bottom 0.152: v30.98,39.13 24.7,39.13 v19.3,33.74
N$32  (via drill 0.35)
  Top 0.152: U$3.P$10 45.46,35.41 45.83,35.04 v45.83,35.03 | v42.77,40.75 42.77,44.25 39.42,47.61 L4.2 | v46.28,22 46.28,17.89 R5.2
  Bottom 0.152: v42.77,40.75 45.83,37.69 v45.83,35.03 46.28,34.58 v46.28,22
N$33
  Top 0.152: U$3.P$11 46.12,36.64 46.12,35.8 46.65,35.27 46.65,34.74 46.6,34.69 46.25,34.32 44.29,32.37 | 44.29,32.37 43.23,31.3 D2.C 44.29,32.37 | 44.29,32.37 37.59,39.07 C4.2
N$34
  Top 0.152: R_LED1.1 45.97,48.22 48.22,48.22 50.06,46.37 59.69,46.37 61.04,46.37 63.34,48.67 LED1.A
N$41
  Bottom 0.152: LED.A 98.4,18.8 98.4,37.91 R_LED2.1
PGC  (via drill 0.35)
  Top 0.152: v26.01,19.72 35.73,19.72 36.34,20.33 39.42,20.33 IC1.27 39.57,20.48 39.87,20.48 40.94,21.55 40.94,27.58 42.01,28.65 v48.62,28.65
  Bottom 0.152: v26.01,19.72 19.76,19.72 19.15,20.33 U$4.5 | R_LED2.2 97.57,39.52 97.57,26.73 74.32,26.73 63.19,37.85 60.08,37.85 50.88,28.65 v48.62,28.65
PGD  (via drill 0.35)
  Top 0.152: 26.85,24.52 39.04,24.52 40.64,22.92 40.64,22.31 40.03,21.7 39.57,21.7 IC1.28 | U$4.4 19,17.74 18.23,16.97 18.23,12.4 18.84,11.79 19.45,11.79 20.97,13.31 20.97,16.65 27.84,23.52 26.85,24.52 | v26.92,41.97 26.92,40.29 29.97,37.24 29.97,34.96 27.38,32.37 26.31,32.37 26.01,32.06 26.01,25.36 26.85,24.52
  Bottom 0.152: v26.92,41.97 42.77,57.82 42.77,63.91 LED3.2
PIC-RX_CABLE-TX
  Top 0.152: IC1.18 39.42,8.9 38.3,8.9 37.96,8.56 37.96,7.4 38.29,7.07 61.97,7.07 63.5,8.59 65.02,8.59 65.33,8.29 65.33,7.53 UART/BT-CABLE.2
PIC-TX_CABLE-RX
  Top 0.152: UART/BT-CABLE.3 65.94,7.53 65.94,8.44 65.48,8.9 59.56,8.9 58.34,7.68 39.57,7.68 IC1.17
PRESSURE-SIG  (via drill 0.35)
  Top 0.152: U$1.P$5 108.3,62.09 110.74,62.09 112.11,60.71 112.11,46.85 110.89,45.63 108.3,45.63 U$1.P$4 109.53,44.29 109.53,32.07 107.39,29.93 106.32,29.93 106.02,29.62 106.02,24.44 110.44,20.02 110.44,18.19 110.28,18.04 104.71,18.04 102.1,20.65 100.44,20.65 99.64,19.85 99.64,13.34 97.18,10.88 U$5.P$1 | IC1.2 30.09,20.21 32.07,20.21 33.15,21.29 v33.15,21.35
  Bottom 0.152: v33.15,21.35 38.51,21.35 41.98,17.88 44.61,17.88 53.9,8.59 94.89,8.59 97.02,10.73 U$5.P$1
PUMP1
  Top 0.152: 61.36,60.1 U$1.PUMP1- | 79.35,45.32 Q1.2
  Top 0.61: 61.36,60.1 64.56,60.1 79.35,45.32
PUMP1-A
  Top 0.152: IC1.6 29.97,15.3 33.93,15.3 35.46,16.82 38.2,16.82 38.5,17.13 40.47,17.13 46.26,22.92 49.48,22.92 52.22,25.66 52.22,26.12 IC3.2
PUMP2
  Top 0.152: 79.35,33.28 Q2.2
  Top 0.61: 79.35,33.28 85.18,39.12 85.18,48.93 90.38,54.13 90.38,57.7 U$1.PUMP2-
PUMP2-A
  Top 0.152: IC1.7 29.97,14.08 35.46,14.08 37.28,15.91 41.48,15.9 42.73,14.64 45.28,14.64 46.55,15.91 46.58,15.91 51.71,21.04 51.71,22.57 54.81,25.66 54.81,26.12 IC3.4
SCK
  Top 0.152: IC1.11 29.82,9.05 24.94,9.05 24.18,9.81 SPI-COMM.3
SDI
  Top 0.152: IC1.13 29.82,6.31 25.55,6.31 24.18,4.94 SPI-COMM.1
SDO
  Top 0.152: IC1.12 29.82,7.53 24.33,7.53 24.18,7.37 SPI-COMM.2
SW1  (via drill 0.35)
  Top 0.152: v37.59,15.3 39.42,15.3 IC1.23 | v27.38,34.81 26.16,36.02 R10.1 26.01,36.18 23.72,38.46 v23.72,41.97
  Bottom 0.152: v37.59,15.3 32.56,20.33 32.1,20.33 27.38,25.05 v27.38,34.81 | v23.72,41.97 23.72,55.84 16.25,63.3 14.58,63.3 13.51,62.24 12.75,62.24 J2.6
SW2  (via drill 0.35)
  Top 0.152: v35.71,15.66 36.56,16.52 39.42,16.52 IC1.24 | v17.47,34.5 17.47,35.72 17.17,36.02 R9.1 17.17,36.18 22.32,41.33 22.32,45.28 11.53,56.07 11.53,62.69 12.6,63.76 12.6,65.13 J2.4
  Bottom 0.152: v17.47,34.5 17.47,33.9 v35.71,15.66
SW3  (via drill 0.35)
  Top 0.152: v33.32,16.97 33.47,17.13 35.19,17.13 35.8,17.74 39.42,17.74 IC1.25 | R8.1 18.39,25.51 18.84,25.97 v18.84,27.03 14.84,31.04 14.84,45.05 9.51,50.37 9.51,63.73 12.6,66.81 12.6,68.18 J2.2
  Bottom 0.152: v33.32,16.97 29.66,16.97 19.61,27.03 v18.84,27.03
VALVE1-A
  Top 0.152: IC1.4 30.15,18.42 35.05,18.42 36.36,19.72 40.48,19.72 41.25,20.48 41.25,25.66 43.53,27.95 53.59,27.95 55.57,29.93 55.57,31.91 53.74,33.74 52.68,33.74 52.37,34.04 52.37,35.72 IC2.2
VALVE2  (via drill 0.35)
  Top 0.152: 49.59,58.04 49.42,58.21 | 76.18,20.78 79.19,20.78 Q3.2 | 48.68,45.31 48.65,45.34 v48.58,45.34
  Top 0.406: U$1.VALVE1- 47.45,60.18 49.42,58.21 | 56.3,37.81 v56.22,37.73 | 76.18,20.78 76.18,21.55 | v50.4,42.77 48.68,44.49 48.68,45.31 | v49.59,48.92 49.59,58.04
  Top 0.61: 56.3,37.81 58.61,37.81 68.24,28.03 69.69,28.03 76.18,21.55
  Bottom 0.152: v56.22,37.73 55.68,37.19 | 49.75,48.76 | 49.75,48.76 v49.59,48.92
  Bottom 0.406: v50.4,42.77 49.98,42.34 49.98,38.13 50.92,37.19 55.68,37.19 | v48.58,45.34 48.58,47.58 49.75,48.76
VALVE2-A  (via drill 0.35)
  Top 0.152: v47.34,27.34 45.67,25.66 45.67,22.77 41.31,18.41 35.76,18.41 35.23,17.88 33.31,17.88 32.1,16.67 29.97,16.67 IC1.5 | v54.81,34.2 54.81,35.72 IC2.4
  Bottom 0.152: v47.34,27.34 47.36,27.34 47.36,29.47 49.04,31.15 51.85,31.15 51.95,31.25 v54.81,34.2
VALVE2-B
  Top 0.152: R2.1 97.68,28.2 96.5,28.2 93.81,25.51 93.81,21.23 90.78,18.19 Q3.1
VPP  (via drill 0.35)
  Top 0.152: 69.59,33.89 69.59,40.14 70.96,41.51 CMCLR.1 | 69.59,33.89 69.59,33.13 RMCLR.2 | U$4.1 19.15,10.27 21.69,12.81 21.69,16.53 26.71,21.55 29.82,21.55 IC1.1 30.1,22.09 31.35,23.34 39.3,23.34 v40.03,22.61 | v65.63,33.89 69.59,33.89
  Bottom 0.152: v65.63,33.89 60.45,33.89 46.12,19.56 45.11,19.56 42.06,22.61 v40.03,22.61
VSS  (via drill 0.35)
  Top 0.152: LED.K 100.83,18.65 100.43,18.24 100.43,11.62 100.55,11.74 U$5.P$2 99.62,10.73 98.09,10.73 97.33,9.96 91.08,9.96 Q4.3 | IC-3.3VREG.2 107.28,3.65 107.28,2.46 105.83,2.46 103.11,5.18 97.37,5.18 97.13,4.84 R13.1 95.56,2.36 88.64,2.36 87.89,3.11 87.89,6.92 90.93,9.96 Q4.3 | Q4.3 90.93,10.12 87.5,13.55 87.5,19.52 90.62,22.65 90.62,23.07 Q3.3 90.78,23.22 90.78,23.3 96.67,29.19 105.13,29.19 106.78,30.84 C6.2 108.16,31.75 108.16,37.96 | 90.62,35.72 90.62,34.83 98.73,34.83 101.86,37.96 108.16,37.96 | 90.62,35.72 90.62,36.18 Q2.3 | Q2.3 88.68,35.68 87.22,37.15 87.22,46.71 89.07,47.8 Q1.3 | 90.62,35.72 Q2.3 | 108.16,37.96 108.16,41.43 v107.08,42.51 107,42.51 105.86,43.64 U$1.P$3 | 55.42,27.86 54.35,27.86 53.74,27.25 53.74,26.27 IC3.3 | CMCLR2.2 55.9,22.3 55.9,26.86 55.42,27.34 55.42,27.86 | 56.93,33.74 55.27,33.74 55.11,33.59 54.51,33.59 53.74,34.35 | 56.93,33.74 60.3,33.74 60.91,33.13 61.21,33.13 CMCLR1.2 | 53.74,34.35 53.74,35.72 IC2.3 | 55.42,27.86 55.42,29.32 56.93,30.83 56.93,33.74 | CMCLR.2 70.96,43.34 70.96,43.64 65.94,48.67 LED1.K | v47.34,39.53 47.04,39.23 45.21,39.23 U$3.P$13 | v52.98,34.35 53.74,34.35 | 67.31,9.81 67.31,13.32 66.09,14.54 66.09,15.91 U$2.P$4 | 67.31,9.81 67.31,7.53 UART/BT-CABLE.5 67.31,7.37 67.76,6.92 67.76,5.85 67.61,5.7 63.19,5.7 61.97,4.48 55.88,4.48 R22.1 | 67.31,9.81 58.77,9.81 57.1,8.14 54.66,8.14 53.44,9.35 R12.1 53.29,9.51 50.09,9.51 47.95,11.64 C2.2 47.8,11.64 46.43,10.27 39.57,10.27 IC1.19 39.42,10.27 39.11,10.27 36.67,12.71 29.97,12.71 IC1.8 29.82,12.86 v26.92,12.86 | J2.5 15.8,62.24 15.8,65.13 J2.3 15.8,65.29 15.8,68.18 J2.1
  Top 0.152: C3.2 19.91,31.45 19.15,31.45 17.54,29.85 16.79,29.85 15.95,30.69 15.95,40.14 20.22,44.41 C1'.- | C5.2 13.36,27.75 13.36,30.84 10.61,33.59 LED2.K 10.46,33.74 5.74,38.46 5.74,42.88 C1'1.-
  Bottom 0.152: OLED.1 112.72,18.04 101.6,18.04 100.99,18.65 LED.K | U$1.BATT1- 117.29,59.04 117.29,48.92 110.88,42.51 v107.08,42.51 107.08,44.66 106.78,44.97 69.64,44.97 65.94,48.67 LED1.K 65.9,47.46 65.19,46.76 63.09,46.76 60.39,49.46 55.36,49.46 LED4.K 54.05,48.06 47.34,41.36 | 47.34,41.36 v47.34,39.53 52.52,34.35 v52.98,34.35 | 20.22,44.56 20.22,57.36 15.8,61.78 15.8,62.09 J2.5 | LED2.K 10.61,33.59 16.56,27.64 16.56,19.11 19,16.67 19,15.45 U$4.3 19.15,15.3 21.59,12.86 v26.92,12.86 | 20.22,44.56 7.26,44.56 5.74,43.04 C1'1.- | 20.22,44.56 C1'.- 20.3,43.85 22.79,41.36 47.34,41.36

### Text on the board
tNames: CMC-NiBP / Control Board